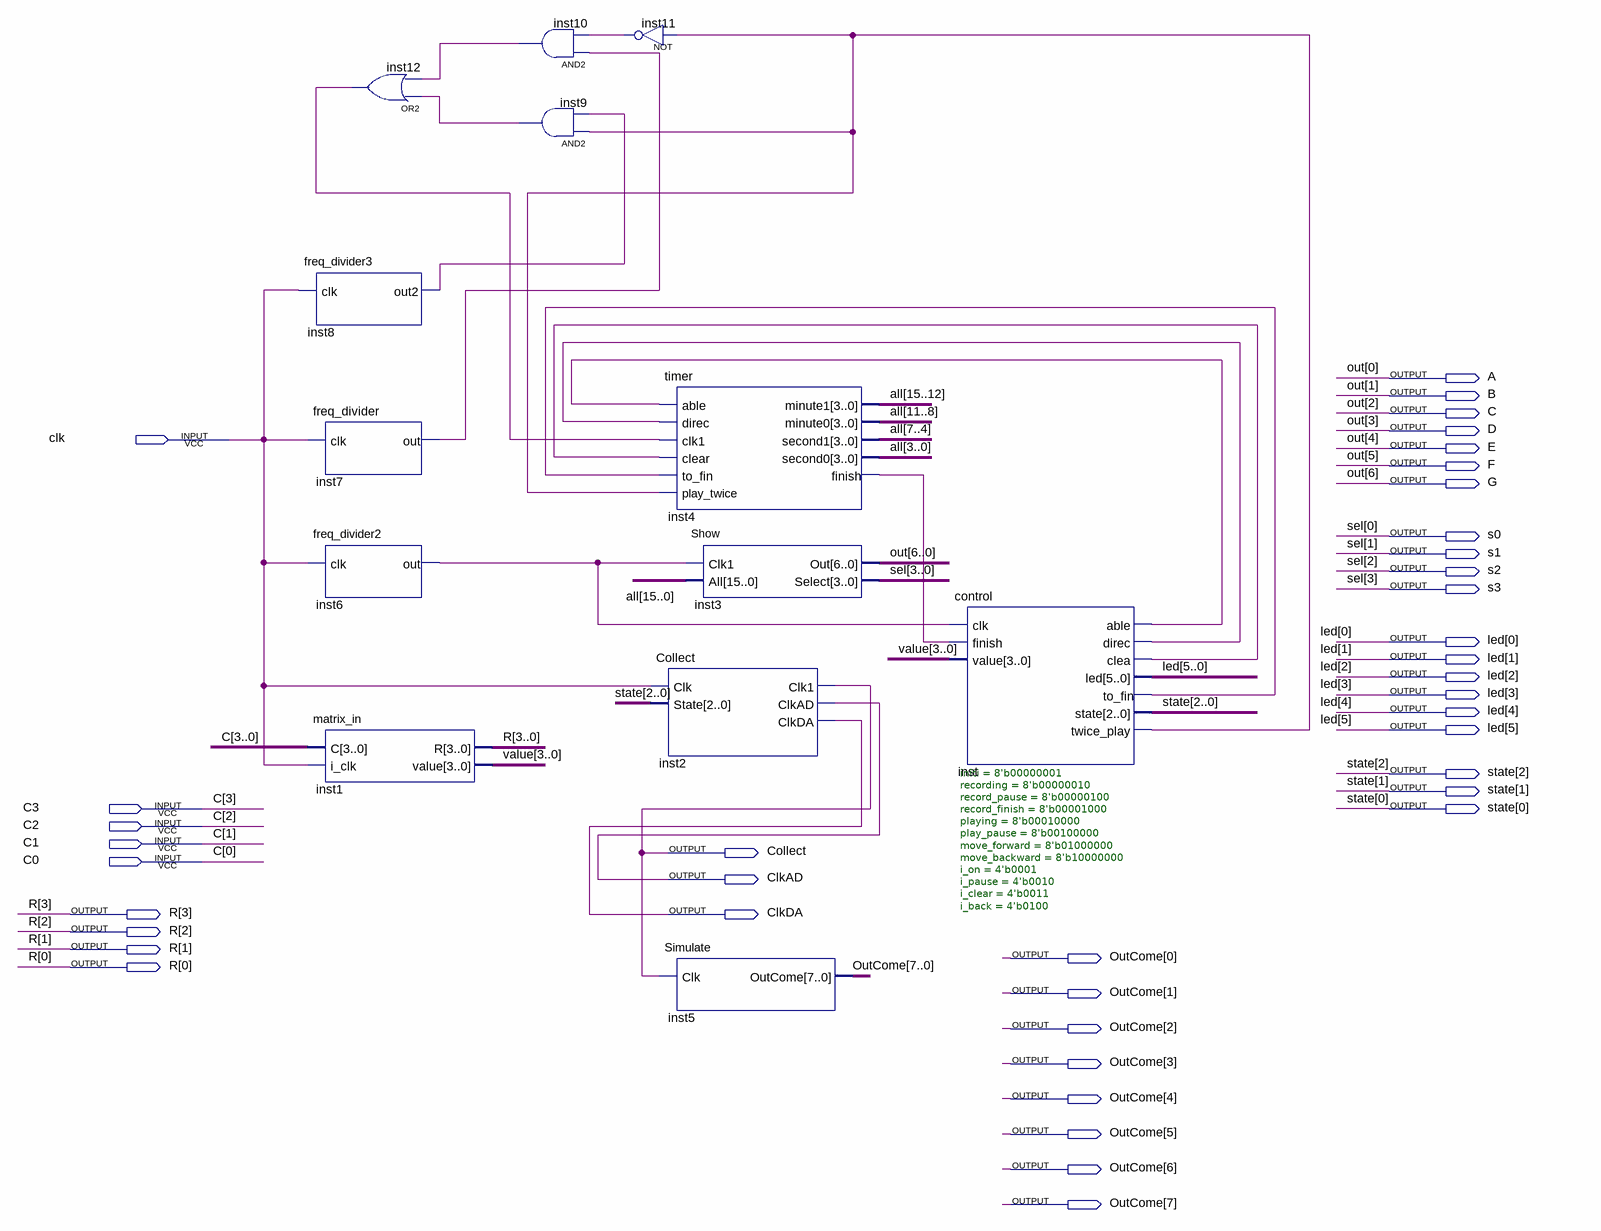
[diagram p0: schematic sheet]
// Quartus schematic task.bdf as structural Verilog: 13 symbols, 40 pins
module \task  (
  input  clk,
  input  C3,
  input  C2,
  input  C1,
  input  C0,
  output A,
  output B,
  output C,
  output D,
  output E,
  output F,
  output G,
  output s0,
  output s1,
  output s2,
  output s3,
  output [5:0] led,
  output [2:0] state,
  output Collect,
  output ClkAD,
  output [3:0] R,
  output ClkDA,
  output [7:0] OutCome
);

  wire inst4_finish, inst6_out, inst7_out, inst8_out2, inst9_out, inst10_out, inst11_out, inst12_out,
       inst_able, inst_clea, inst_direc, inst_to_fin, inst_twice_play;
  wire [3:0] value;
  wire [15:0] all;

  freq_divider3 inst8 (.clk(clk), .out2(inst8_out2));
  freq_divider inst7 (.clk(clk), .out(inst7_out));
  freq_divider2 inst6 (.clk(clk), .out(inst6_out));
  matrix_in inst1 (.C({C3, C2, C1, C0}), .i_clk(clk), .R(R), .value(value));
  or inst12 (inst12_out, inst9_out, inst10_out);
  and inst10 (inst10_out, inst7_out, inst11_out);
  and inst9 (inst9_out, inst_twice_play, inst8_out2);
  not inst11 (inst11_out, inst_twice_play);
  timer inst4 (
    .able(inst_able), .direc(inst_direc), .clk1(inst12_out), .clear(inst_clea), .to_fin(inst_to_fin),
    .play_twice(inst_twice_play), .minute1(all[15:12]), .minute0(all[11:8]), .second1(all[7:4]),
    .second0(all[3:0]), .finish(inst4_finish));
  Collect inst2 (.Clk(clk), .State(state), .Clk1(Collect), .ClkAD(ClkAD), .ClkDA(ClkDA));
  Simulate inst5 (.Clk(Collect), .OutCome(OutCome));
  Show inst3 (.Clk1(inst6_out), .All(all), .Out({G, F, E, D, C, B, A}), .Select({s3, s2, s1, s0}));
  control #(.initi(8'b00000001), .recording(8'b00000010), .record_pause(8'b00000100), .record_finish(8'b00001000), .playing(8'b00010000), .play_pause(8'b00100000), .move_forward(8'b01000000), .move_backward(8'b10000000), .i_on(4'b0001), .i_pause(4'b0010), .i_clear(4'b0011), .i_back(4'b0100)) inst (
    .clk(inst6_out), .finish(inst4_finish), .value(value), .able(inst_able), .direc(inst_direc),
    .clea(inst_clea), .led(led), .to_fin(inst_to_fin), .state(state), .twice_play(inst_twice_play));

  // Other names for the same wires on the sheet: out[6:0] = {G, F, E, D, C, B, A}; sel[3:0] = {s3, s2, s1, s0}
endmodule
